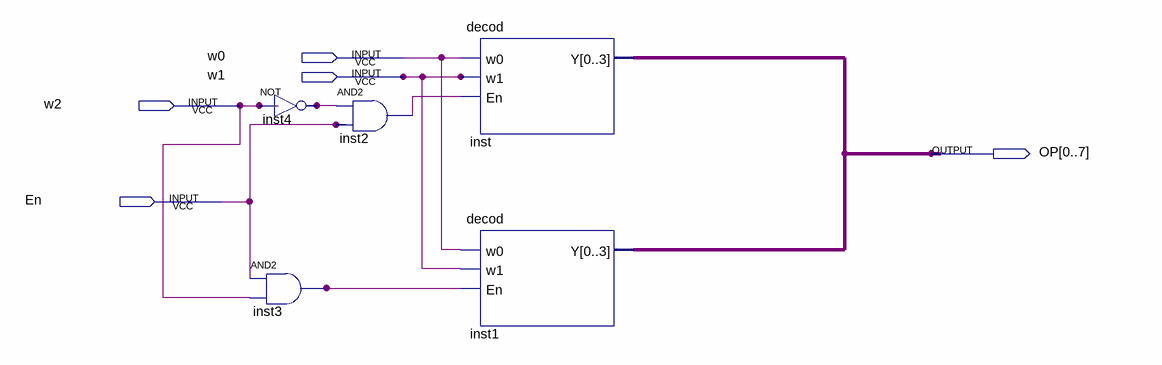
[diagram p0: schematic sheet]
// Quartus schematic 3to8decoder.bdf as structural Verilog: 5 symbols, 5 pins
module \3to8decoder  (
  input  w0,
  input  w1,
  input  w2,
  input  En,
  output [0:7] OP
);

  wire inst2_out, inst3_out, inst4_out;

  not inst4 (inst4_out, w2);
  and inst3 (inst3_out, En, w2);
  and inst2 (inst2_out, inst4_out, En);
  decod inst (.w0(w0), .w1(w1), .En(inst2_out), .Y(OP));
  decod inst1 (.w0(w0), .w1(w1), .En(inst3_out), .Y(OP));
endmodule
